# Altium schematic sheet Hoja_Buck.SchDoc: Hoja_Buck
size A4; SheetNumber: 5; SheetTotal: 6; Time: Hoja_Buck
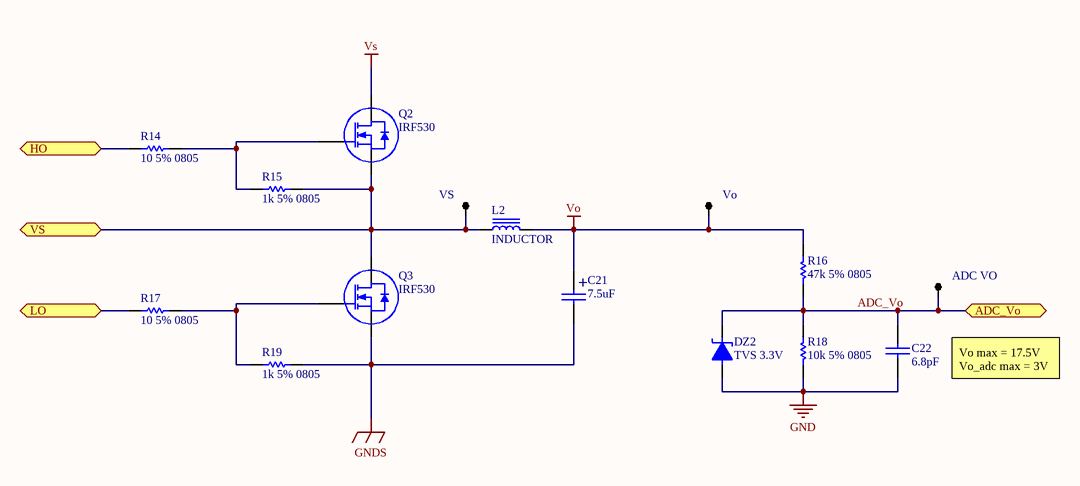
[diagram p0: Hoja_Buck.SchDoc]

## Parts
ADC_VO  ADC Vo  [TPTH]  (value not drawn)
C21  7.5uF  [CAPSMD10x10.3]
C22  6.8pF  [0805]
DZ2  TVS 3.3V  [sod123]
L2  INDUCTOR  [IND_HCTI-220-5.8]
Q2  IRF530  [TO-220 V]
Q3  IRF530  [TO-220 V]
R14  10 5% 0805  [0805]
R15  1k 5% 0805  [0805]
R16  47k 5% 0805  [0805]
R17  10 5% 0805  [0805]
R18  10k 5% 0805  [0805]
R19  1k 5% 0805  [0805]
Vo  Vo  [TPTH]  (value not drawn)
VS  VS  [TPTH]  (value not drawn)

## Ports
ADC_Vo (bidir), HO (bidir), LO (bidir), VS (bidir)

## Nets
GND: C22.2 DZ2.1 R18.1
GNDS: C21.2 Q3.3(S) R19.1
Vo: C21.1 L2.2 R16.2 Vo.1
Vs: Q2.2(D)
ADC_Vo: ADC_VO.1 C22.1 DZ2.2 R16.1 R18.2 ; port ADC_Vo
HO: R14.2 ; port HO
LO: R17.2 ; port LO
VS: L2.1 Q2.3(S) Q3.2(D) R15.1 VS.1 ; port VS  [a separate net that carries the same name]
NetQ2_1: Q2.1(G) R14.1 R15.2
NetQ3_1: Q3.1(G) R17.1 R19.2

## Notes on the sheet
- Vo max = 17.5V
  Vo_adc max = 3V
- Title:
- Size:
- Author:
- A4
- Sheet
- of
- Revision:
- File:
- Date:
- (in symbol CAPPOL) +

## Library data of the parts
ADC_VO Vo VS = TP
C21 = CAPPOL: CAP ALUM 7.5UF 20% 450V SMD
C22 = CAP
DZ2 = DIODO ZENER
Q2 Q3 = MOSFET N
R14-R19 = RES